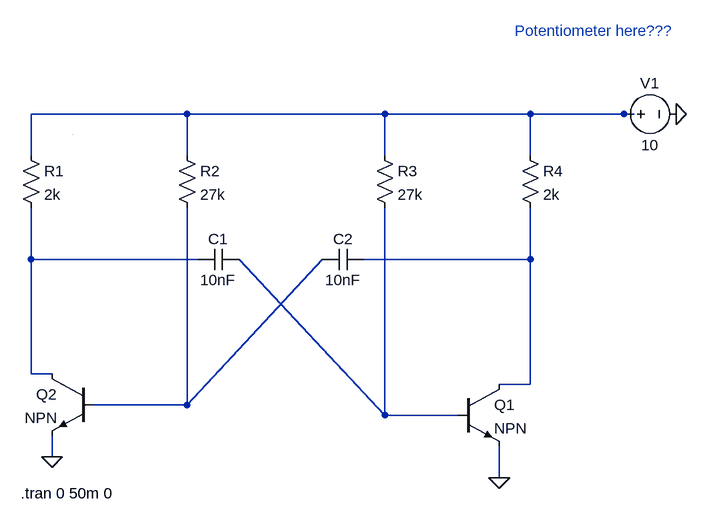
[diagram p0: schematic Square_wave_BJT.asc]
Square_wave_BJT.asc, the LTspice schematic file:
Version 4.1
SHEET 1 948 680
WIRE 176 -32 -64 -32
WIRE 480 -32 176 -32
WIRE 704 -32 480 -32
WIRE 848 -32 704 -32
WIRE 864 -32 848 -32
WIRE -64 32 -64 -32
WIRE 176 32 176 -32
WIRE 480 32 480 -32
WIRE 704 32 704 -32
WIRE -64 192 -64 112
WIRE 192 192 -64 192
WIRE 704 192 704 112
WIRE 704 192 448 192
WIRE -64 368 -64 192
WIRE -32 368 -64 368
WIRE 704 384 704 192
WIRE 704 384 656 384
WIRE 176 416 176 112
WIRE 176 416 384 192
WIRE 176 416 32 416
WIRE 480 432 480 112
WIRE 480 432 256 192
WIRE 592 432 480 432
WIRE -32 496 -32 464
WIRE 656 528 656 480
WIRE 0 0 0 0
FLAG 928 -32 0
FLAG 656 528 0
FLAG -32 496 0
SYMBOL voltage 832 -32 R270
WINDOW 0 32 56 VTop 2
WINDOW 3 -32 56 VBottom 2
WINDOW 123 0 0 Left 0
WINDOW 39 0 0 Left 0
SYMATTR InstName V1
SYMATTR Value 10
SYMBOL res -80 16 R0
SYMATTR InstName R1
SYMATTR Value 2k
SYMBOL res 160 16 R0
SYMATTR InstName R2
SYMATTR Value 27k
SYMBOL res 464 16 R0
SYMATTR InstName R3
SYMATTR Value 27k
SYMBOL res 688 16 R0
SYMATTR InstName R4
SYMATTR Value 2k
SYMBOL npn 592 384 R0
SYMATTR InstName Q1
SYMBOL npn 32 368 M0
SYMATTR InstName Q2
SYMBOL cap 256 176 R90
WINDOW 0 0 32 VBottom 2
WINDOW 3 32 32 VTop 2
SYMATTR InstName C1
SYMATTR Value 10nF
SYMBOL cap 448 176 R90
WINDOW 0 0 32 VBottom 2
WINDOW 3 32 32 VTop 2
SYMATTR InstName C2
SYMATTR Value 10nF
TEXT -80 552 Left 2 !.tran 0 50m 0
TEXT 680 -160 Left 2 ;Potentiometer here???

The netlist it stands for:
* Square_wave_BJT.asc
V1 N001 0 10
R1 N001 N002 2k
R2 N001 N004 27k
R3 N001 N005 27k
R4 N001 N003 2k
Q1 N003 N005 0 0 NPN
Q2 N002 N004 0 0 NPN
C1 N005 N002 10nF
C2 N003 N004 10nF
.model NPN NPN
.model PNP PNP
.lib standard.bjt
.tran 0 50m 0
* Potentiometer here???
.backanno
.end